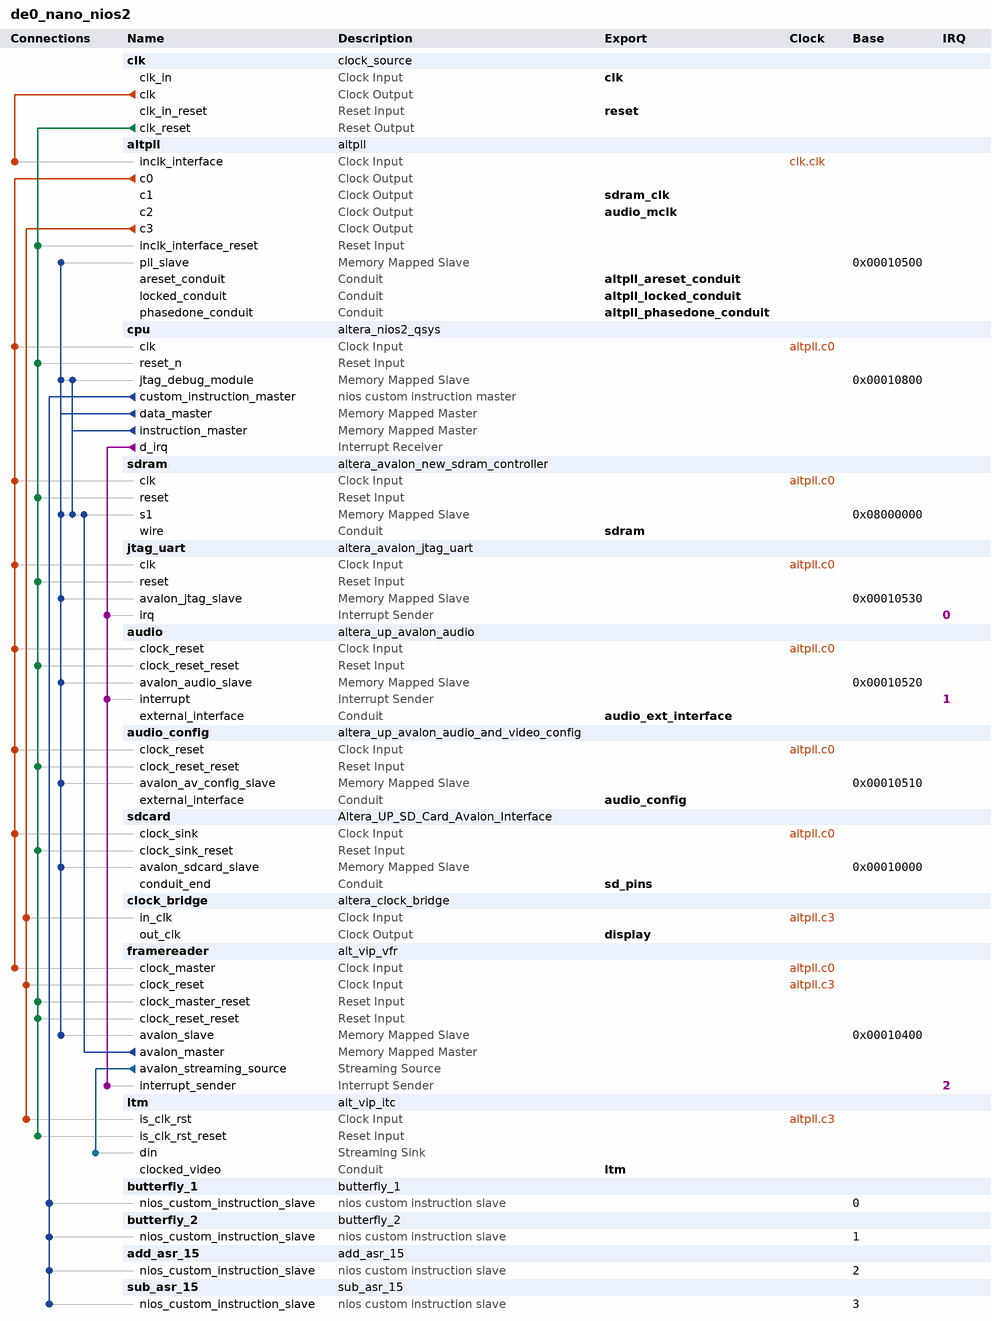
[diagram p0: system contents]
# Platform Designer (Qsys) system de0_nano_nios2, Cyclone IV E EP4CE115F29C7
# Parameters at their usual value, and those the tool derives, are not listed.
package require -exact qsys 13.1
create_system de0_nano_nios2
set_project_property DEVICE_FAMILY {Cyclone IV E}
set_project_property DEVICE EP4CE115F29C7

add_instance clk clock_source 13.1
set_instance_parameter_value clk clockFrequency 50000000

add_instance altpll altpll 13.1
set_instance_parameter_value altpll INCLK0_INPUT_FREQUENCY 20000
set_instance_parameter_value altpll CLK0_MULTIPLY_BY 2
set_instance_parameter_value altpll CLK1_MULTIPLY_BY 2
set_instance_parameter_value altpll CLK2_MULTIPLY_BY 3528
set_instance_parameter_value altpll CLK3_MULTIPLY_BY 1
set_instance_parameter_value altpll CLK4_MULTIPLY_BY 1
set_instance_parameter_value altpll CLK0_DIVIDE_BY 1
set_instance_parameter_value altpll CLK1_DIVIDE_BY 1
set_instance_parameter_value altpll CLK2_DIVIDE_BY 15625
set_instance_parameter_value altpll CLK3_DIVIDE_BY 2
set_instance_parameter_value altpll CLK4_DIVIDE_BY 1
set_instance_parameter_value altpll CLK1_PHASE_SHIFT -1833
set_instance_parameter_value altpll CLK2_PHASE_SHIFT 0
set_instance_parameter_value altpll CLK3_PHASE_SHIFT 0
set_instance_parameter_value altpll CLK4_PHASE_SHIFT 0
set_instance_parameter_value altpll CLK1_DUTY_CYCLE 50
set_instance_parameter_value altpll CLK2_DUTY_CYCLE 50
set_instance_parameter_value altpll CLK3_DUTY_CYCLE 50
set_instance_parameter_value altpll CLK4_DUTY_CYCLE 50
set_instance_parameter_value altpll PORT_clk1 PORT_USED
set_instance_parameter_value altpll PORT_clk2 PORT_USED
set_instance_parameter_value altpll PORT_clk3 PORT_USED
set_instance_parameter_value altpll PORT_clk4 PORT_USED
set_instance_parameter_value altpll PORT_ARESET PORT_USED
set_instance_parameter_value altpll PORT_LOCKED PORT_USED

add_instance cpu altera_nios2_qsys 13.1
set_instance_parameter_value cpu resetSlave sdram.s1
set_instance_parameter_value cpu mmu_TLBMissExcSlave onchip_mem.s1
set_instance_parameter_value cpu exceptionSlave sdram.s1
set_instance_parameter_value cpu breakSlave cpu.jtag_debug_module
set_instance_parameter_value cpu impl Fast
set_instance_parameter_value cpu icache_size 4096
set_instance_parameter_value cpu dcache_size 4096

add_instance sdram altera_avalon_new_sdram_controller 13.1
set_instance_parameter_value sdram TAC 5.5
set_instance_parameter_value sdram TRCD 20.0
set_instance_parameter_value sdram TRP 20.0
set_instance_parameter_value sdram casLatency 3
set_instance_parameter_value sdram columnWidth 10
set_instance_parameter_value sdram dataWidth 32
set_instance_parameter_value sdram generateSimulationModel false
set_instance_parameter_value sdram model single_Micron_MT48LC4M32B2_7_chip
set_instance_parameter_value sdram numberOfBanks 4
set_instance_parameter_value sdram numberOfChipSelects 1
set_instance_parameter_value sdram powerUpDelay 100.0
set_instance_parameter_value sdram refreshPeriod 15.625
set_instance_parameter_value sdram rowWidth 13

add_instance jtag_uart altera_avalon_jtag_uart 13.1
set_instance_parameter_value jtag_uart simInteractiveOptions NO_INTERACTIVE_WINDOWS

add_instance audio altera_up_avalon_audio 13.1
set_instance_parameter_value audio avalon_bus_type {Memory Mapped}
set_instance_parameter_value audio audio_in true
set_instance_parameter_value audio dw 16

add_instance audio_config altera_up_avalon_audio_and_video_config 13.1
set_instance_parameter_value audio_config board DE2-115
set_instance_parameter_value audio_config audio_in {Microphone to ADC}
set_instance_parameter_value audio_config line_in_bypass false
set_instance_parameter_value audio_config bit_length 16
set_instance_parameter_value audio_config sampling_rate {48 kHz}

add_instance sdcard Altera_UP_SD_Card_Avalon_Interface 13.1

add_instance clock_bridge altera_clock_bridge 13.1
set_instance_parameter_value clock_bridge DERIVED_CLOCK_RATE 25000000
set_instance_parameter_value clock_bridge EXPLICIT_CLOCK_RATE 0

add_instance framereader alt_vip_vfr 13.1
set_instance_parameter_value framereader NUMBER_OF_CHANNELS_IN_PARALLEL 3
set_instance_parameter_value framereader MAX_IMAGE_WIDTH 800
set_instance_parameter_value framereader MAX_IMAGE_HEIGHT 480
set_instance_parameter_value framereader MEM_PORT_WIDTH 32

add_instance ltm alt_vip_itc 13.1
set_instance_parameter_value ltm NUMBER_OF_COLOUR_PLANES 3
set_instance_parameter_value ltm H_ACTIVE_PIXELS 800
set_instance_parameter_value ltm V_ACTIVE_LINES 480
set_instance_parameter_value ltm FIFO_DEPTH 1024
set_instance_parameter_value ltm CLOCKS_ARE_SAME 1
set_instance_parameter_value ltm THRESHOLD 1023
set_instance_parameter_value ltm H_SYNC_LENGTH 1
set_instance_parameter_value ltm H_FRONT_PORCH 40
set_instance_parameter_value ltm H_BACK_PORCH 216
set_instance_parameter_value ltm V_SYNC_LENGTH 1
set_instance_parameter_value ltm V_FRONT_PORCH 10
set_instance_parameter_value ltm V_BACK_PORCH 35

add_instance butterfly_1 butterfly_1 1.0

add_instance butterfly_2 butterfly_2 1.0

add_instance add_asr_15 add_asr_15 1.0

add_instance sub_asr_15 sub_asr_15 1.0

# connections
add_connection altpll.c0 audio.clock_reset clock
add_connection altpll.c0 audio_config.clock_reset clock
add_connection altpll.c0 cpu.clk clock
add_connection altpll.c0 framereader.clock_master clock
add_connection altpll.c0 jtag_uart.clk clock
add_connection altpll.c0 sdcard.clock_sink clock
add_connection altpll.c0 sdram.clk clock
add_connection altpll.c3 clock_bridge.in_clk clock
add_connection altpll.c3 framereader.clock_reset clock
add_connection altpll.c3 ltm.is_clk_rst clock
add_connection clk.clk altpll.inclk_interface clock
add_connection clk.clk_reset altpll.inclk_interface_reset reset
add_connection clk.clk_reset audio.clock_reset_reset reset
add_connection clk.clk_reset audio_config.clock_reset_reset reset
add_connection clk.clk_reset cpu.reset_n reset
add_connection clk.clk_reset framereader.clock_master_reset reset
add_connection clk.clk_reset framereader.clock_reset_reset reset
add_connection clk.clk_reset jtag_uart.reset reset
add_connection clk.clk_reset ltm.is_clk_rst_reset reset
add_connection clk.clk_reset sdcard.clock_sink_reset reset
add_connection clk.clk_reset sdram.reset reset
add_connection cpu.data_master altpll.pll_slave avalon
set_connection_parameter_value cpu.data_master/altpll.pll_slave baseAddress 0x00010500
add_connection cpu.data_master audio.avalon_audio_slave avalon
set_connection_parameter_value cpu.data_master/audio.avalon_audio_slave baseAddress 0x00010520
add_connection cpu.data_master audio_config.avalon_av_config_slave avalon
set_connection_parameter_value cpu.data_master/audio_config.avalon_av_config_slave baseAddress 0x00010510
add_connection cpu.data_master cpu.jtag_debug_module avalon
set_connection_parameter_value cpu.data_master/cpu.jtag_debug_module baseAddress 0x00010800
add_connection cpu.data_master framereader.avalon_slave avalon
set_connection_parameter_value cpu.data_master/framereader.avalon_slave baseAddress 0x00010400
add_connection cpu.data_master jtag_uart.avalon_jtag_slave avalon
set_connection_parameter_value cpu.data_master/jtag_uart.avalon_jtag_slave baseAddress 0x00010530
add_connection cpu.data_master sdcard.avalon_sdcard_slave avalon
set_connection_parameter_value cpu.data_master/sdcard.avalon_sdcard_slave baseAddress 0x00010000
add_connection cpu.data_master sdram.s1 avalon
set_connection_parameter_value cpu.data_master/sdram.s1 baseAddress 0x08000000
add_connection cpu.instruction_master cpu.jtag_debug_module avalon
set_connection_parameter_value cpu.instruction_master/cpu.jtag_debug_module baseAddress 0x00010800
add_connection cpu.instruction_master sdram.s1 avalon
set_connection_parameter_value cpu.instruction_master/sdram.s1 baseAddress 0x08000000
add_connection framereader.avalon_master sdram.s1 avalon
set_connection_parameter_value framereader.avalon_master/sdram.s1 baseAddress 0x08000000
add_connection framereader.avalon_streaming_source ltm.din avalon_streaming
add_connection cpu.d_irq audio.interrupt interrupt
set_connection_parameter_value cpu.d_irq/audio.interrupt irqNumber 1
add_connection cpu.d_irq framereader.interrupt_sender interrupt
set_connection_parameter_value cpu.d_irq/framereader.interrupt_sender irqNumber 2
add_connection cpu.d_irq jtag_uart.irq interrupt
set_connection_parameter_value cpu.d_irq/jtag_uart.irq irqNumber 0
add_connection cpu.custom_instruction_master add_asr_15.nios_custom_instruction_slave nios_custom_instruction
set_connection_parameter_value cpu.custom_instruction_master/add_asr_15.nios_custom_instruction_slave CIName add_asr_15
set_connection_parameter_value cpu.custom_instruction_master/add_asr_15.nios_custom_instruction_slave baseAddress 2
add_connection cpu.custom_instruction_master butterfly_1.nios_custom_instruction_slave nios_custom_instruction
set_connection_parameter_value cpu.custom_instruction_master/butterfly_1.nios_custom_instruction_slave CIName butterfly_1
set_connection_parameter_value cpu.custom_instruction_master/butterfly_1.nios_custom_instruction_slave baseAddress 0
add_connection cpu.custom_instruction_master butterfly_2.nios_custom_instruction_slave nios_custom_instruction
set_connection_parameter_value cpu.custom_instruction_master/butterfly_2.nios_custom_instruction_slave CIName butterfly_2
set_connection_parameter_value cpu.custom_instruction_master/butterfly_2.nios_custom_instruction_slave baseAddress 1
add_connection cpu.custom_instruction_master sub_asr_15.nios_custom_instruction_slave nios_custom_instruction
set_connection_parameter_value cpu.custom_instruction_master/sub_asr_15.nios_custom_instruction_slave CIName sub_asr_15
set_connection_parameter_value cpu.custom_instruction_master/sub_asr_15.nios_custom_instruction_slave baseAddress 3

# exported interfaces
add_interface reset reset sink
set_interface_property reset EXPORT_OF clk.clk_in_reset
add_interface clk clock sink
set_interface_property clk EXPORT_OF clk.clk_in
add_interface audio_config conduit end
set_interface_property audio_config EXPORT_OF audio_config.external_interface
add_interface audio_ext_interface conduit end
set_interface_property audio_ext_interface EXPORT_OF audio.external_interface
add_interface sd_pins conduit end
set_interface_property sd_pins EXPORT_OF sdcard.conduit_end
add_interface sdram conduit end
set_interface_property sdram EXPORT_OF sdram.wire
add_interface display clock source
set_interface_property display EXPORT_OF clock_bridge.out_clk
add_interface ltm conduit end
set_interface_property ltm EXPORT_OF ltm.clocked_video
add_interface altpll_phasedone_conduit conduit end
set_interface_property altpll_phasedone_conduit EXPORT_OF altpll.phasedone_conduit
add_interface altpll_locked_conduit conduit end
set_interface_property altpll_locked_conduit EXPORT_OF altpll.locked_conduit
add_interface altpll_areset_conduit conduit end
set_interface_property altpll_areset_conduit EXPORT_OF altpll.areset_conduit
add_interface audio_mclk clock source
set_interface_property audio_mclk EXPORT_OF altpll.c2
add_interface sdram_clk clock source
set_interface_property sdram_clk EXPORT_OF altpll.c1

set_interconnect_requirement {$system} qsys_mm.clockCrossingAdapter HANDSHAKE
set_interconnect_requirement {$system} qsys_mm.maxAdditionalLatency 1

save_system de0_nano_nios2.qsys
